# Altium schematic sheet ESP32_CAN_V2-main.SchDoc: ESP32 CAN V2
size A4; DrawnBy: Balazs Finaczy, Laszlo Goczan; SheetNumber: 1; SheetTotal: 6
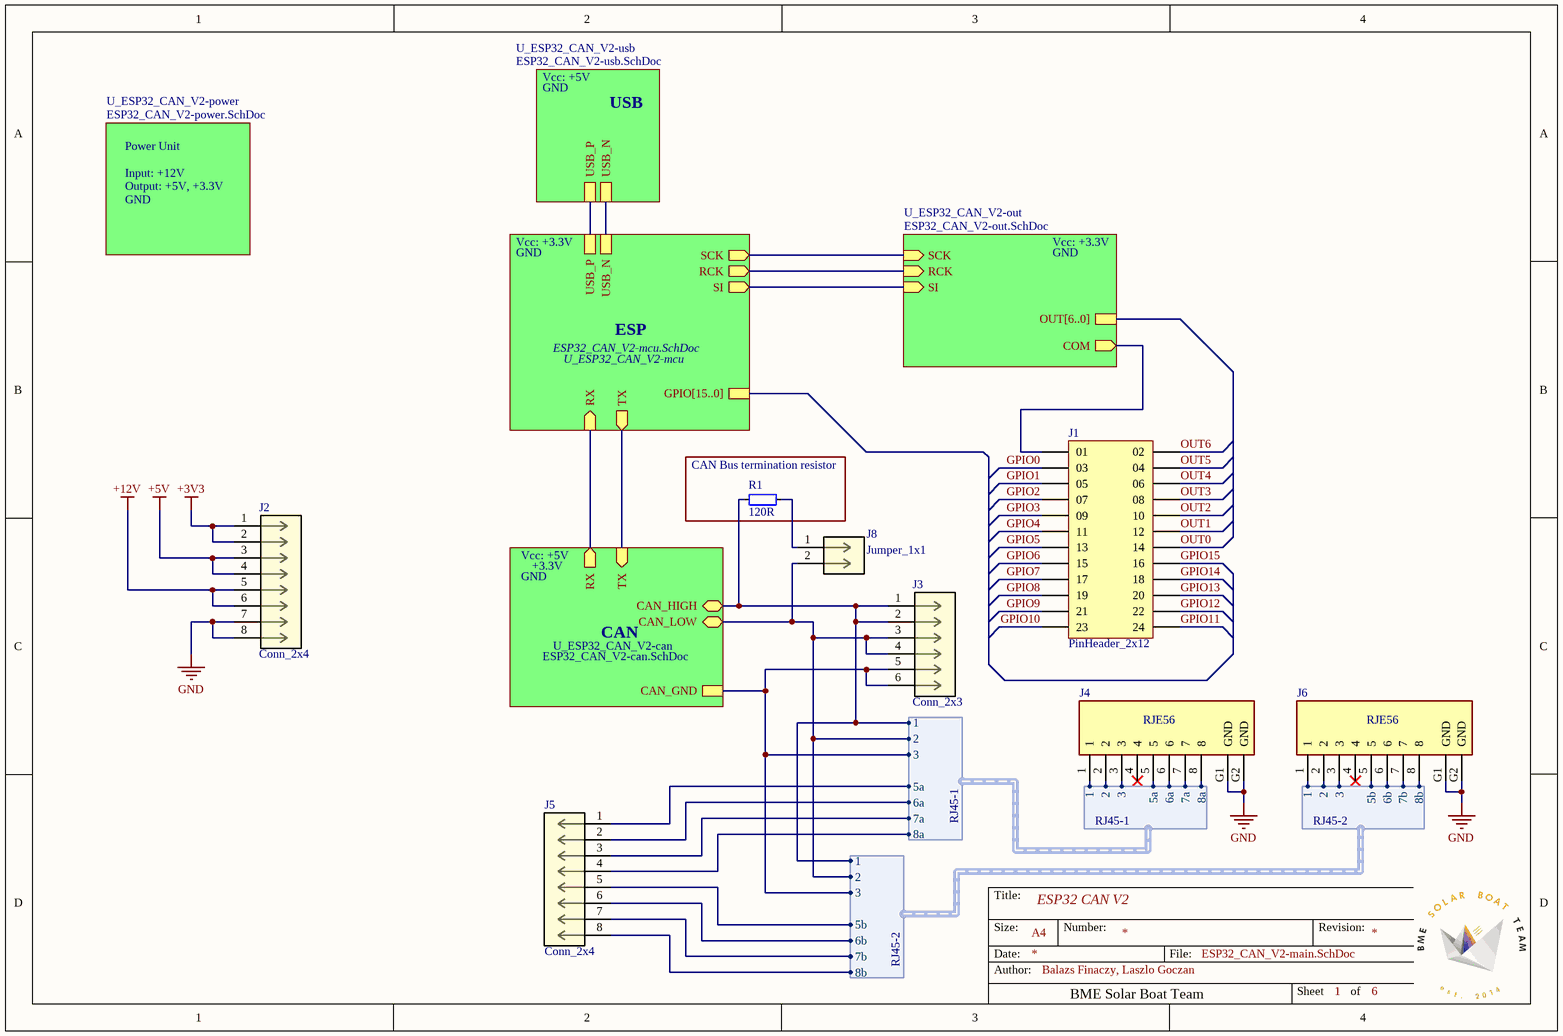
[diagram p0: ESP32_CAN_V2-main.SchDoc]

## Parts
J1  PinHeader_2x12  [AMPHENOL_10129381-924003BLF]
J2  Conn_2x4  [CONN_10129381-X08002XLF_AMP]
J3  Conn_2x3  [CONN_10129381-X08002XLF_AMP]
J4  RJE56  [AMPHENOL_RJE561881410]
J5  Conn_2x4  [CONN_10129381-X08002XLF_AMP]
J6  RJE56  [AMPHENOL_RJE561881410]
J8  Jumper_1x1  [CON2_1X2_TU_TSW]
R1  120R  [R0603]

## Blocks framed on the sheet
CAN Bus termination resistor: R1

## Sub-sheets
U_ESP32_CAN_V2-can = ESP32_CAN_V2-can.SchDoc: RX (out), TX (in), CAN_HIGH (bidir), CAN_LOW (bidir), CAN_GND
U_ESP32_CAN_V2-mcu = ESP32_CAN_V2-mcu.SchDoc: TX (out), RX (in), SCK (out), RCK (out), SI (out), GPIO[15..0], USB_N, USB_P
U_ESP32_CAN_V2-out = ESP32_CAN_V2-out.SchDoc: SI (in), RCK (in), SCK (in), COM (out), OUT[6..0]
U_ESP32_CAN_V2-power = ESP32_CAN_V2-power.SchDoc: no entries
U_ESP32_CAN_V2-usb = ESP32_CAN_V2-usb.SchDoc: USB_N, USB_P

## Harnesses
RJ45-1: 1, 2, 3, 5a, 6a, 7a, 8a
RJ45-2: 1, 2, 3, 5b, 6b, 7b, 8b

## Nets
+3V3: J2.1 J2.2
+5V: J2.3 J2.4
+12V: J2.5 J2.6
GND: J2.7 J2.8 J4.G1(GND) J4.G2(GND) J6.G1(GND) J6.G2(GND)
GPIO0: J1.03
GPIO1: J1.05
GPIO2: J1.07
GPIO3: J1.09
GPIO4: J1.11
GPIO5: J1.13
GPIO6: J1.15
GPIO7: J1.17
GPIO8: J1.19
GPIO9: J1.21
GPIO10: J1.23
GPIO11: J1.24
GPIO12: J1.22
GPIO13: J1.20
GPIO14: J1.18
GPIO15: J1.16
OUT0: J1.14
OUT1: J1.12
OUT2: J1.10
OUT3: J1.08
OUT4: J1.06
OUT5: J1.04
OUT6: J1.02
NetJ1_01: J1.01 ; sheet U_ESP32_CAN_V2-out/COM
NetJ3_1: J3.1 J3.2 J4.1 J6.1 R1.1 ; sheet U_ESP32_CAN_V2-can/CAN_HIGH, harness RJ45-1.1, harness RJ45-2.1
NetJ3_3: J3.3 J3.4 J4.2 J6.2 J8.2 ; sheet U_ESP32_CAN_V2-can/CAN_LOW, harness RJ45-1.2, harness RJ45-2.2
NetJ3_5: J3.5 J3.6 J4.3 J6.3 ; sheet U_ESP32_CAN_V2-can/CAN_GND, harness RJ45-1.3, harness RJ45-2.3
NetJ4_5: J4.5 J5.1 ; harness RJ45-1.5a
NetJ4_6: J4.6 J5.2 ; harness RJ45-1.6a
NetJ4_7: J4.7 J5.3 ; harness RJ45-1.7a
NetJ4_8: J4.8 J5.4 ; harness RJ45-1.8a
NetJ5_5: J5.5 J6.5 ; harness RJ45-2.5b
NetJ5_6: J5.6 J6.6 ; harness RJ45-2.6b
NetJ5_7: J5.7 J6.7 ; harness RJ45-2.7b
NetJ5_8: J5.8 J6.8 ; harness RJ45-2.8b
NetJ8_1: J8.1 R1.2
(unnamed): sheet U_ESP32_CAN_V2-mcu/TX, sheet U_ESP32_CAN_V2-can/TX
(unnamed): sheet U_ESP32_CAN_V2-mcu/RX, sheet U_ESP32_CAN_V2-can/RX
(unnamed): sheet U_ESP32_CAN_V2-mcu/SCK, sheet U_ESP32_CAN_V2-out/SCK
(unnamed): sheet U_ESP32_CAN_V2-mcu/RCK, sheet U_ESP32_CAN_V2-out/RCK
(unnamed): sheet U_ESP32_CAN_V2-mcu/SI, sheet U_ESP32_CAN_V2-out/SI
(unnamed): sheet U_ESP32_CAN_V2-mcu/USB_N, sheet U_ESP32_CAN_V2-usb/USB_N
(unnamed): sheet U_ESP32_CAN_V2-mcu/USB_P, sheet U_ESP32_CAN_V2-usb/USB_P

Not connected (* = marked no-connect by the designer): J4 4*; J6 4*

## Notes on the sheet
- Vcc: +5V
- GND
- USB
- Power Unit
- Input: +12V
- Output: +5V, +3.3V
- Vcc: +3.3V
- ESP
- +3.3V
- CAN
- Title:
- Size:
- Date:
- Author:
- A4
- Number:
- BME Solar Boat Team
- File:
- Revision:
- Sheet
- of

## Library data of the parts
J1 = PinHeader_2x12: MF: {'manufacturer': u'Amphenol ICC (FCI)'}; MP: 10129381-924003BLF; Package: None; Price: None; Value: *; Availability: Unavailable
J2 J5 = PinHeader_2x4: Manufacturer_Name: Amphenol ICC; Manufacturer_Part_Number: 10129381-908002BLF; Copyright: Copyright (C) 2026 Ultra Librarian. All rights reserved.; RefDes: RefDes; Type: Type
J3 = PinHeader_2x3_1: Manufacturer_Name: Amphenol ICC; Manufacturer_Part_Number: 10129381-908002BLF; Copyright: Copyright (C) 2026 Ultra Librarian. All rights reserved.; RefDes: RefDes; Type: Type
J4 J6 = RJE561881410: Modular Jack - Right Angle, Input Output Connectors 8P8C, Without Shield .; MF: Amphenol Commercial Products; Reference: RJE56-188-1410; SnapEDA_Link: https://www.snapeda.com/parts/RJE561881410/Amphenol/view-part/?ref=snap; Package: None; Value: *; MP: RJE561881410; Check_prices: https://www.snapeda.com/parts/RJE561881410/Amphenol/view-part/?ref=eda; Type: RJE56; Supplier: Farnell
J8 = TSW-102-08-T-S: No Description Available; Manufacturer_Name: Samtec Inc; Copyright: Copyright (C) 2026 Ultra Librarian. All rights reserved.; Manufacturer_Part_Number: TSW-102-08-T-S; RefDes: RefDes; Type: Type
R1 = R